# Altium schematic sheet MK64 Power ADC.SchDoc
size Letter
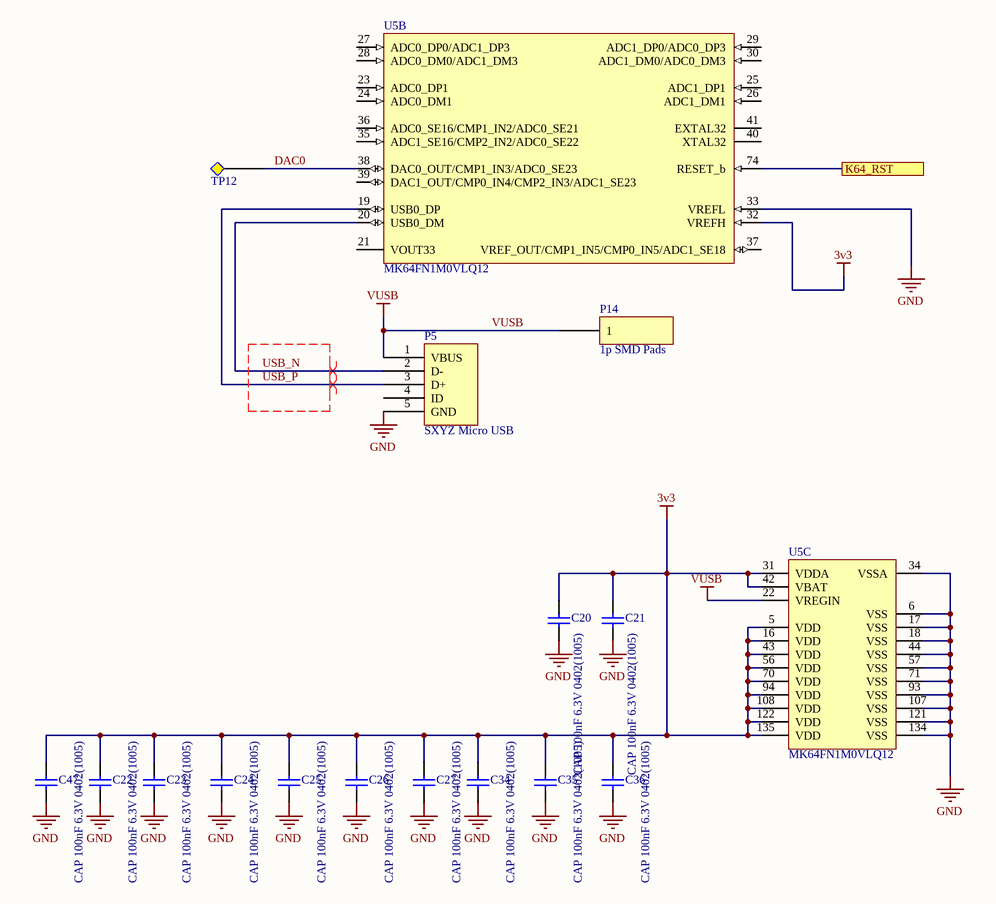
[diagram p0: MK64 Power ADC.SchDoc]

## Parts
C20  CAP 100nF 6.3V 0402(1005)  [CAPC0402(1005)60_M]
C21  CAP 100nF 6.3V 0402(1005)  [CAPC0402(1005)60_M]
C22  CAP 100nF 6.3V 0402(1005)  [CAPC0402(1005)60_M]
C23  CAP 100nF 6.3V 0402(1005)  [CAPC0402(1005)60_M]
C24  CAP 100nF 6.3V 0402(1005)  [CAPC0402(1005)60_M]
C25  CAP 100nF 6.3V 0402(1005)  [CAPC0402(1005)60_M]
C26  CAP 100nF 6.3V 0402(1005)  [CAPC0402(1005)60_M]
C27  CAP 100nF 6.3V 0402(1005)  [CAPC0402(1005)60_M]
C34  CAP 100nF 6.3V 0402(1005)  [CAPC0402(1005)60_M]
C35  CAP 100nF 6.3V 0402(1005)  [CAPC0402(1005)60_M]
C36  CAP 100nF 6.3V 0402(1005)  [CAPC0402(1005)60_M]
C47  CAP 100nF 6.3V 0402(1005)  [CAPC0402(1005)60_M]
P5  SXYZ Micro USB  [SXYZ Micro USB]
P14  1p SMD Pads  [1p SMD pad]
TP12  Test Point  [TP]  (value not drawn)  (no BOM)
U5  MK64FN1M0VLQ12  [918-03_N]  (parts B,C of 3)

## Ports
K64_RST

## Nets
3v3: C20.2 C21.2 C22.2 C23.2 C24.2 C25.2 C26.2 C27.2 C34.2 C35.2 C36.2 C47.2 U5.5(VDD) U5.16(VDD) U5.31(VDDA) U5.32(VREFH) U5.42(VBAT) U5.43(VDD) U5.56(VDD) U5.70(VDD) U5.94(VDD) U5.108(VDD) U5.122(VDD) U5.135(VDD)
GND: C20.1 C21.1 C22.1 C23.1 C24.1 C25.1 C26.1 C27.1 C34.1 C35.1 C36.1 C47.1 P5.5(GND) U5.6(VSS) U5.17(VSS) U5.18(VSS) U5.33(VREFL) U5.34(VSSA) U5.44(VSS) U5.57(VSS) U5.71(VSS) U5.93(VSS) U5.107(VSS) U5.121(VSS) U5.134(VSS)
VUSB: P5.1(VBUS) P14.1 U5.22(VREGIN)
DAC0: TP12.1 U5.38(DAC0_OUT/CMP1_IN3/ADC0_SE23)
K64_RST: U5.74(RESET_b) ; port K64_RST
USB_N: P5.2(D-) U5.20(USB0_DM)
USB_P: P5.3(D+) U5.19(USB0_DP)

Not connected (* = marked no-connect by the designer): P5 4(ID); U5 21(VOUT33) 23(ADC0_DP1) 24(ADC0_DM1) 25(ADC1_DP1) 26(ADC1_DM1) 27(ADC0_DP0/ADC1_DP3) 28(ADC0_DM0/ADC1_DM3) 29(ADC1_DP0/ADC0_DP3) 30(ADC1_DM0/ADC0_DM3) 35(ADC1_SE16/CMP2_IN2/ADC0_SE22) 36(ADC0_SE16/CMP1_IN2/ADC0_SE21) 37(VREF_OUT/CMP1_IN5/CMP0_IN5/ADC1_SE18) 39(DAC1_OUT/CMP0_IN4/CMP2_IN3/ADC1_SE23) 40(XTAL32) 41(EXTAL32)

## Layout directives
differential pair: USB_N, USB_P

## Notes on the sheet
- Title
- Size:
- Date:
- Letter
- Number:
- Time:
- Revision:
- Sheet
- of
- Copyright 2019
- Specialized Solutions LLC
- 206 W Lincoln Hwy STE B
- New Haven, IN 46774
- www.specsolns.com <http://www.specsolns.com>
- File:

## Library data of the parts
C20-C27 C34-C36 C47 = CMP-1034-02062-1: CAP 100nF 6.3V ±20% 0402 (1005 Metric) Thickness 0.6mm SMD; Case-EIA: 0402; Tolerance: Â±20%; Case-Metric: 1005; Value: 100nF; Technology: SMT; Max Thickness: 0.6 mm; Rated Voltage: 6.3 V
P5 = SXYZ MicroUSB: Micro USB Connector
P14 = 1p SMD
TP12 = TP
U5 = CMP-0182-00046-1: Cortex-M4-based Microcontroller with FPU, 1 MB, 120 MHz, 1.71 to 3.6 V, -40 to 105 degC, 144-Pin QFP (918-03), RoHS, Tray; Manufacturer: Freescale Semiconductor; SRAM: 256 KB; Flash: 1 MB; ComponentLink2URL: http://cache.freescale.com/files/microcontrollers/doc/data_sheet/K64P144M120SF5.pdf?pspll=1; VDD: 1.71 to 3.6 V; PackageDescription: 144-Pin Plastic Quad Flat Package, Body 20 x 20 mm, Pitch 0.5 mm; Temperature Range: -40 to 105 degC; ComponentLink1URL: http://www.freescale.com/; ComponentLink3Description: Package Specification; PartNumber: MK64FN1M0VLQ12; VBAT: 1.71 to 3.6 V; ComponentLink1Description: Manufacturer URL; ComponentLink3URL: http://cache.freescale.com/files/shared/doc/package_info/98ASS23177W.pdf; DatasheetVersion: Rev. 3; PackageVersion: Rev. G; RoHS: TRUE; Mounting Technology: Surface Mount; Packing: Tray; VDDA: 1.71 to 3.6 V; ComponentLink2Description: Datasheet; PartId: 2